# Altium schematic sheet Block Diagram.SchDoc: AA Design Challenge
size 431 x 279 mm; Revision: 1.0; SheetNumber: 1; SheetTotal: 4; ProjectName: TRK_GPRS_GNSS_BTLE
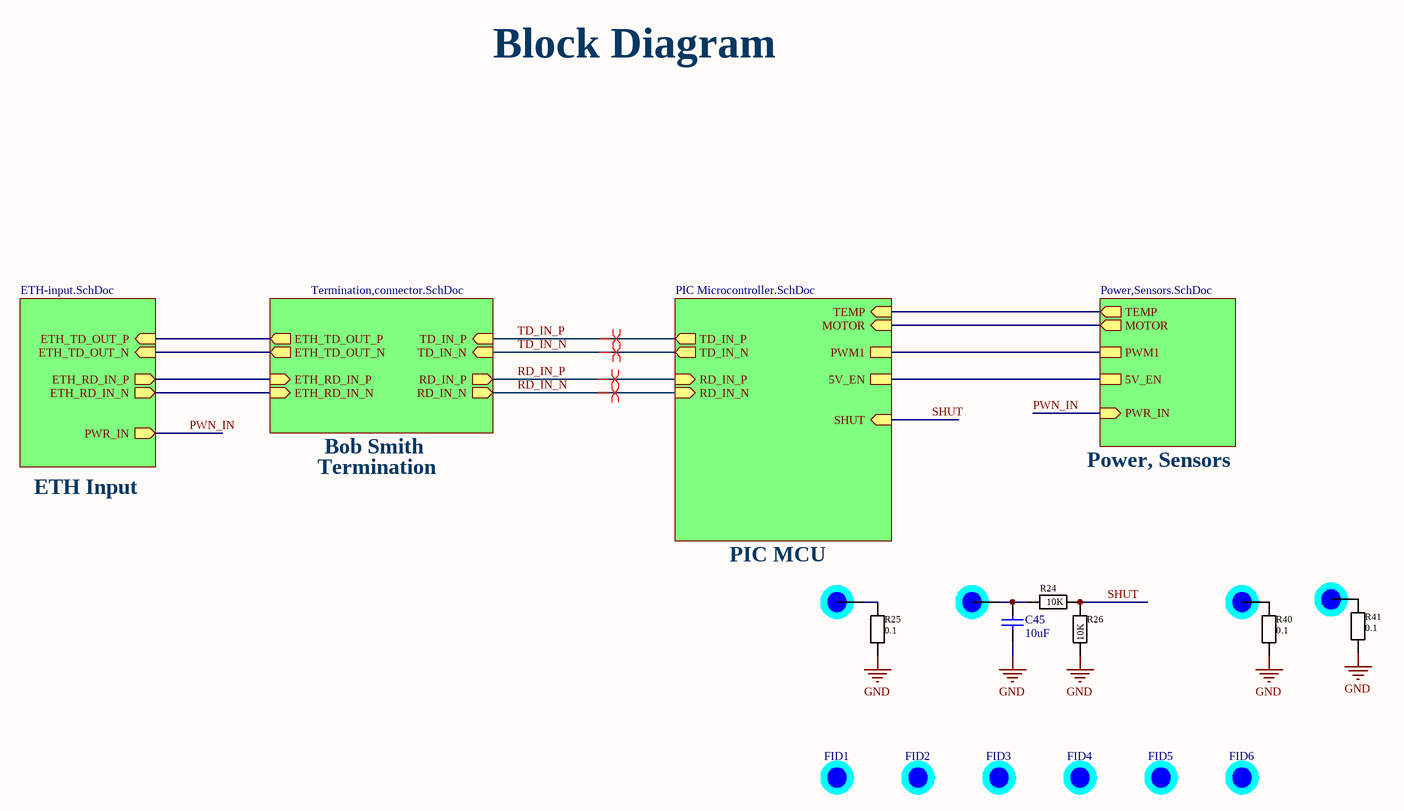
[diagram p0: Block Diagram.SchDoc]

## Parts
C45  10uF  [CAPC1005X61USR]
FID1  Fiducial 1mm  [FIDUCIAL_1MM_RND]  (value not drawn)  (no BOM)
FID2  Fiducial 1mm  [FIDUCIAL_1MM_RND]  (value not drawn)  (no BOM)
FID3  Fiducial 1mm  [FIDUCIAL_1MM_RND]  (value not drawn)  (no BOM)
FID4  Fiducial 1mm  [FIDUCIAL_1MM_RND]  (value not drawn)  (no BOM)
FID5  Fiducial 1mm  [FIDUCIAL_1MM_RND]  (value not drawn)  (no BOM)
FID6  Fiducial 1mm  [FIDUCIAL_1MM_RND]  (value not drawn)  (no BOM)
MH1  MH_1.5mm  [MH_2mm]  (value not drawn)  (no BOM)
MH2  MH_1.5mm  [MH_2mm]  (value not drawn)  (no BOM)
MH3  MH_1.5mm  [MH_2mm]  (value not drawn)  (no BOM)
MH4  MH_1.5mm  [MH_2mm]  (value not drawn)  (no BOM)
R24  10K  [RESC1005X40USR]
R25  0.1  [RESC2012X65USR]
R26  10K  [RESC1005X40USR]
R40  0.1  [RESC2012X65USR]
R41  0.1  [RESC2012X65USR]

## Sub-sheets
Designator = PIC Microcontroller.SchDoc: TD_IN_P (out), TD_IN_N (out), RD_IN_P (in), RD_IN_N (in), TEMP (in), PWM1, 5V_EN, SHUT (in), MOTOR (in)
Designator = Power,Sensors.SchDoc: TEMP (out), PWM1, 5V_EN, MOTOR (out), PWR_IN (in)
Designator = Termination,connector.SchDoc: TD_IN_P (in), TD_IN_N (in), RD_IN_P (out), RD_IN_N (out), ETH_TD_OUT_P (out), ETH_TD_OUT_N (out), ETH_RD_IN_P (in), ETH_RD_IN_N (in)
Designator = ETH-input.SchDoc: ETH_TD_OUT_P (in), ETH_TD_OUT_N (in), ETH_RD_IN_P (out), ETH_RD_IN_N (out), PWR_IN (out)

## Nets
GND: C45.2 R25.1 R26.2 R40.1 R41.1
PWN_IN: sheet Designator/PWR_IN, sheet Designator/PWR_IN
RD_IN_N: sheet Designator/RD_IN_N, sheet Designator/RD_IN_N
RD_IN_P: sheet Designator/RD_IN_P, sheet Designator/RD_IN_P
SHUT: R24.2 R26.1 ; sheet Designator/SHUT
TD_IN_N: sheet Designator/TD_IN_N, sheet Designator/TD_IN_N
TD_IN_P: sheet Designator/TD_IN_P, sheet Designator/TD_IN_P
NetC45_1: C45.1 MH2.1 R24.1
NetMH1_1: MH1.1 R25.2
NetMH3_1: MH3.1 R40.2
NetMH4_1: MH4.1 R41.2
(unnamed): sheet Designator/TEMP, sheet Designator/TEMP
(unnamed): sheet Designator/PWM1, sheet Designator/PWM1
(unnamed): sheet Designator/5V_EN, sheet Designator/5V_EN
(unnamed): sheet Designator/MOTOR, sheet Designator/MOTOR
(unnamed): sheet Designator/ETH_TD_OUT_P, sheet Designator/ETH_TD_OUT_P
(unnamed): sheet Designator/ETH_TD_OUT_N, sheet Designator/ETH_TD_OUT_N
(unnamed): sheet Designator/ETH_RD_IN_P, sheet Designator/ETH_RD_IN_P
(unnamed): sheet Designator/ETH_RD_IN_N, sheet Designator/ETH_RD_IN_N

## Layout directives
differential pair: RD_IN_N, RD_IN_P, TD_IN_N, TD_IN_P

## Notes on the sheet
- Block Diagram
- Bob Smith
- ETH Input
- Termination
- Power, Sensors
- (near MH1) PIC MCU
- DWG. NO.
- REV.
- SHT.
- THIS DOCUMENT AND THE DATA DISCLOSED HEREIN OR HEREWITH IS THE PROPERTY OF ALTIUM LIMITED AND MAY BE FREELY DISTRIBUTED IN WHOLE. NO RIGHTS ARE RESERVED OR EXPRESS OR IMPLIED WARANTEE GIVEN.
- REVISION
- DESCRIPTION
- DATE
- APPROVED
- ENG:
- APPROVALS
- PROJECT
- DSN:
- CHK:
- REFERENCE DOCUMENTS
- PROJECT REVISION:
- TITLE
- DOCUMENT REVISION:
- DESIGN ITEM:
- BOM:
- FAB DWG:
- PCB DWG:
- ASSY DWG:
- SCALE:
- SIZE
- B
- CAGE CODE
- FILE NAME
- DWG NO.
- SHEET
- OF
- REV

## Library data of the parts
C45 = Cap: CAP CER 10UF 10V X5R 0402; Manufacturer: Samsung Electro-Mechanics; Manufacturer Part Number: CL05A106MP8NUB8; Supplier Part Number 1: 1276-6830-2-ND; Supplier Part Number 2: *; Supplier 1: *; Supplier 2: *; 100pc cost: *; 1pc cost: *; Height: *; value: 10uF
FID1-FID6 = FIDUCIAL_1MM_RND: Component Description: Fiducial 1mm
MH1-MH4 = MH_1.5mm: Component Description: Fiducial 1mm
R24 R26 = R: RES 10K OHM 1% 1/16W 0402; Manufacturer: Stackpole Electronics Inc; Manufacturer Part Number: RMCF0402FT10K0; Power Rating: 62.5mW; Tolerance: +/-1%; Voltage Rating: NA; Distributor: DigiKey; Value: 10K; Distributor Art. Nbr.: RMCF0402FT10K0TR-ND; Package: EIA-0402; Price Estim. @ 100pcs: 0.0049; Height: 0.40mm
R25 R40 R41 = R: RES 0.1 OHM 1% 1/8W 0805; Manufacturer: Yageo; Manufacturer Part Number: RL0805FR-070R1L; Tolerance: +/-1%; Voltage Rating: NA; Distributor: DigiKey; Value: 0.1; Distributor Art. Nbr.: 311-.10STR-ND; Package: EIA-0805; Height: 0.60mm